# Altium schematic sheet boost_stage.SchDoc
size A3; SheetNumber: 2; SheetTotal: 2
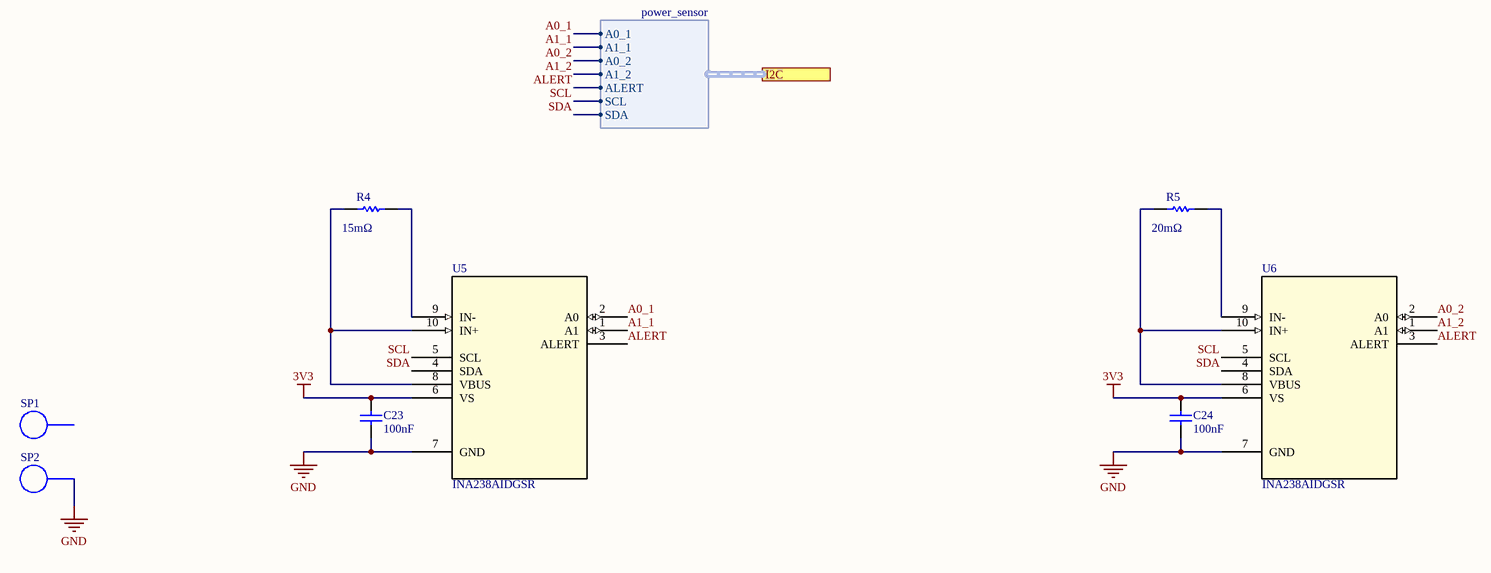
[diagram p0: boost_stage.SchDoc]

## Parts
C23  value 100nF  [C0603]  (hidden comment: CC0603KRX7R8BB104)
C24  value 100nF  [C0603]  (hidden comment: CC0603KRX7R8BB104)
R4  value 15mΩ  [FP-PA2512E-R007-0R10-MFG]  (hidden comment: PA2512FKE7T0R015E)
R5  value 20mΩ  [FP-PA2512E-R007-0R10-MFG]  (hidden comment: PA2512FKF7W0R02E)
SP1  Solder Pad  [Solder Pad-Footprint-1]  (value not drawn)
SP2  Solder Pad  [Solder Pad-Footprint-1]  (value not drawn)
U5  INA238AIDGSR  [VSSOP_8AIDGST_TEX]
U6  INA238AIDGSR  [VSSOP_8AIDGST_TEX]

## Ports
I2C (harness power_sensor)

## Harnesses
power_sensor: A0_1, A1_1, A0_2, A1_2, ALERT, SCL, SDA

## Nets
3V3: C23.2 C24.2 U5.6(VS) U6.6(VS)
GND: C23.1 C24.1 SP2.SP(Solder_Pad) U5.7(GND) U6.7(GND)
A0_1: U5.2(A0) ; port I2C.A0_1
A0_2: U6.2(A0) ; port I2C.A0_2
A1_1: U5.1(A1) ; port I2C.A1_1
A1_2: U6.1(A1) ; port I2C.A1_2
ALERT: U5.3(ALERT) U6.3(ALERT) ; port I2C.ALERT
SCL: U5.5(SCL) U6.5(SCL) ; port I2C.SCL
SDA: U5.4(SDA) U6.4(SDA) ; port I2C.SDA
NetR4_1: R4.1 U5.8(VBUS) U5.10(IN+)
NetR4_2: R4.2 U5.9(IN-)
NetR5_1: R5.1 U6.8(VBUS) U6.10(IN+)
NetR5_2: R5.2 U6.9(IN-)

Not connected (* = marked no-connect by the designer): SP1 SP(Solder_Pad)

## Library data of the parts
C23 C24 = CMP-00179-1: 25V 100nF X7R ±10% 0603 Multilayer Ceramic Capacitors MLCC - SMD/SMT ROHS; Length: 1.6mm; Pins: 2; Case/Package: 0603; Composition: Ceramic; Lead Free: Lead Free; Lifecycle Status: Production; RoHS: Compliant; China RoHS: Compliant; Number of Terminals: 2; Max Operating Temperature: 125°C; Tolerance: 10%; Width: 800µm; Dielectric Material: Ceramic; Voltage Rating (DC): 25V; Depth: 800µm; Min Operating Temperature: -55°C; Halogen Free: Halogen Free; Mounting Technology: Surface Mount; Material: Ceramic; REACH SVHC: Yes; Case Code (Imperial): 0603; Height: 800µm; Schedule B: 8532240020, 8532240020; Voltage Rating: 25V; Thickness: 889µm; Termination: SMD/SMT; Dielectric: X7R; Radiation Hardening: No; Voltage: 25V; Case Code (Metric): 1608
R4 = CMP-00212-2: Fixed Resistor, 3W, 0.015ohm, 0.2121V, 1% +/-Tol, 50ppm/Cel, Surface Mount, 2512; Manufacturer Package Identifier: PA2512E-R007-0R10; Temperature Coefficient: 50ppm/°C; Working Voltage: 212.1mV; Harmonized Tariff Schedule (HTS) Code: 8533.21.00.30; Max Operating Temperature: 170°C; Country of Origin: Mainland China, Taiwan; Height: 630µm; Export Control Classification Number (ECCN) Code: EAR99; China RoHS: Compliant; Width: 3.18mm; Mounting Technology: Surface Mount; Power Rating: 3W; Lifecycle Status: Production; Min Operating Temperature: -55°C; Composition: Metal Element; Case/Package: 2512; Power Dissipation: 3W; RoHS: Compliant; REACH SVHC: Yes; Tolerance: 1%; Number of Terminals: 2; Introduction Date: 2016-04-07
R5 = CMP-RES-00052-1: Current Sensor-Low TCR Chip Resistor Automotive Grade Metal Film 2512 20mOhm 1% Emboss T/R; Manufacturer Package Identifier: PA2512E-R007-0R10; Power Dissipation: 2W; Working Voltage: 200mV; Power Rating: 3W; Temperature Coefficient: 100ppm/°C; Composition: Metal Element; Height: 630µm; Harmonized Tariff Schedule (HTS) Code: 8533.21.00.30; Case/Package: 2512; RoHS: Compliant; Introduction Date: 2016-04-07; Country of Origin: Mainland China, Taiwan; Tolerance: 1%; Max Operating Temperature: 170°C; Export Control Classification Number (ECCN) Code: EAR99; REACH SVHC: Yes; Mounting Technology: Surface Mount; Number of Terminals: 2; China RoHS: Compliant; Width: 3.18mm; Min Operating Temperature: -55°C; Lifecycle Status: Production
SP1 SP2 = CMP-014-000043-2: 64mm^2 solder pad for wire to board connections,
U5 U6 = CMP-192-000000-1: 85-V, 16-bit, high-precision I2C output current/voltage/power monitor with alert 10-VSSOP -40 to 125; Manufacturer_Name: Texas Instruments; Design Item ID: INA238AIDGSR; RefDes: RefDes; Source: INA238AIDGSR.SchLib; Manufacturer_Part_Number: INA238AIDGSR; Type: Type; Copyright: Copyright (C) 2026 Ultra Librarian. All rights reserved.